# EAGLE design prometeo_002_non_plated (EAGLE 7.6.0)
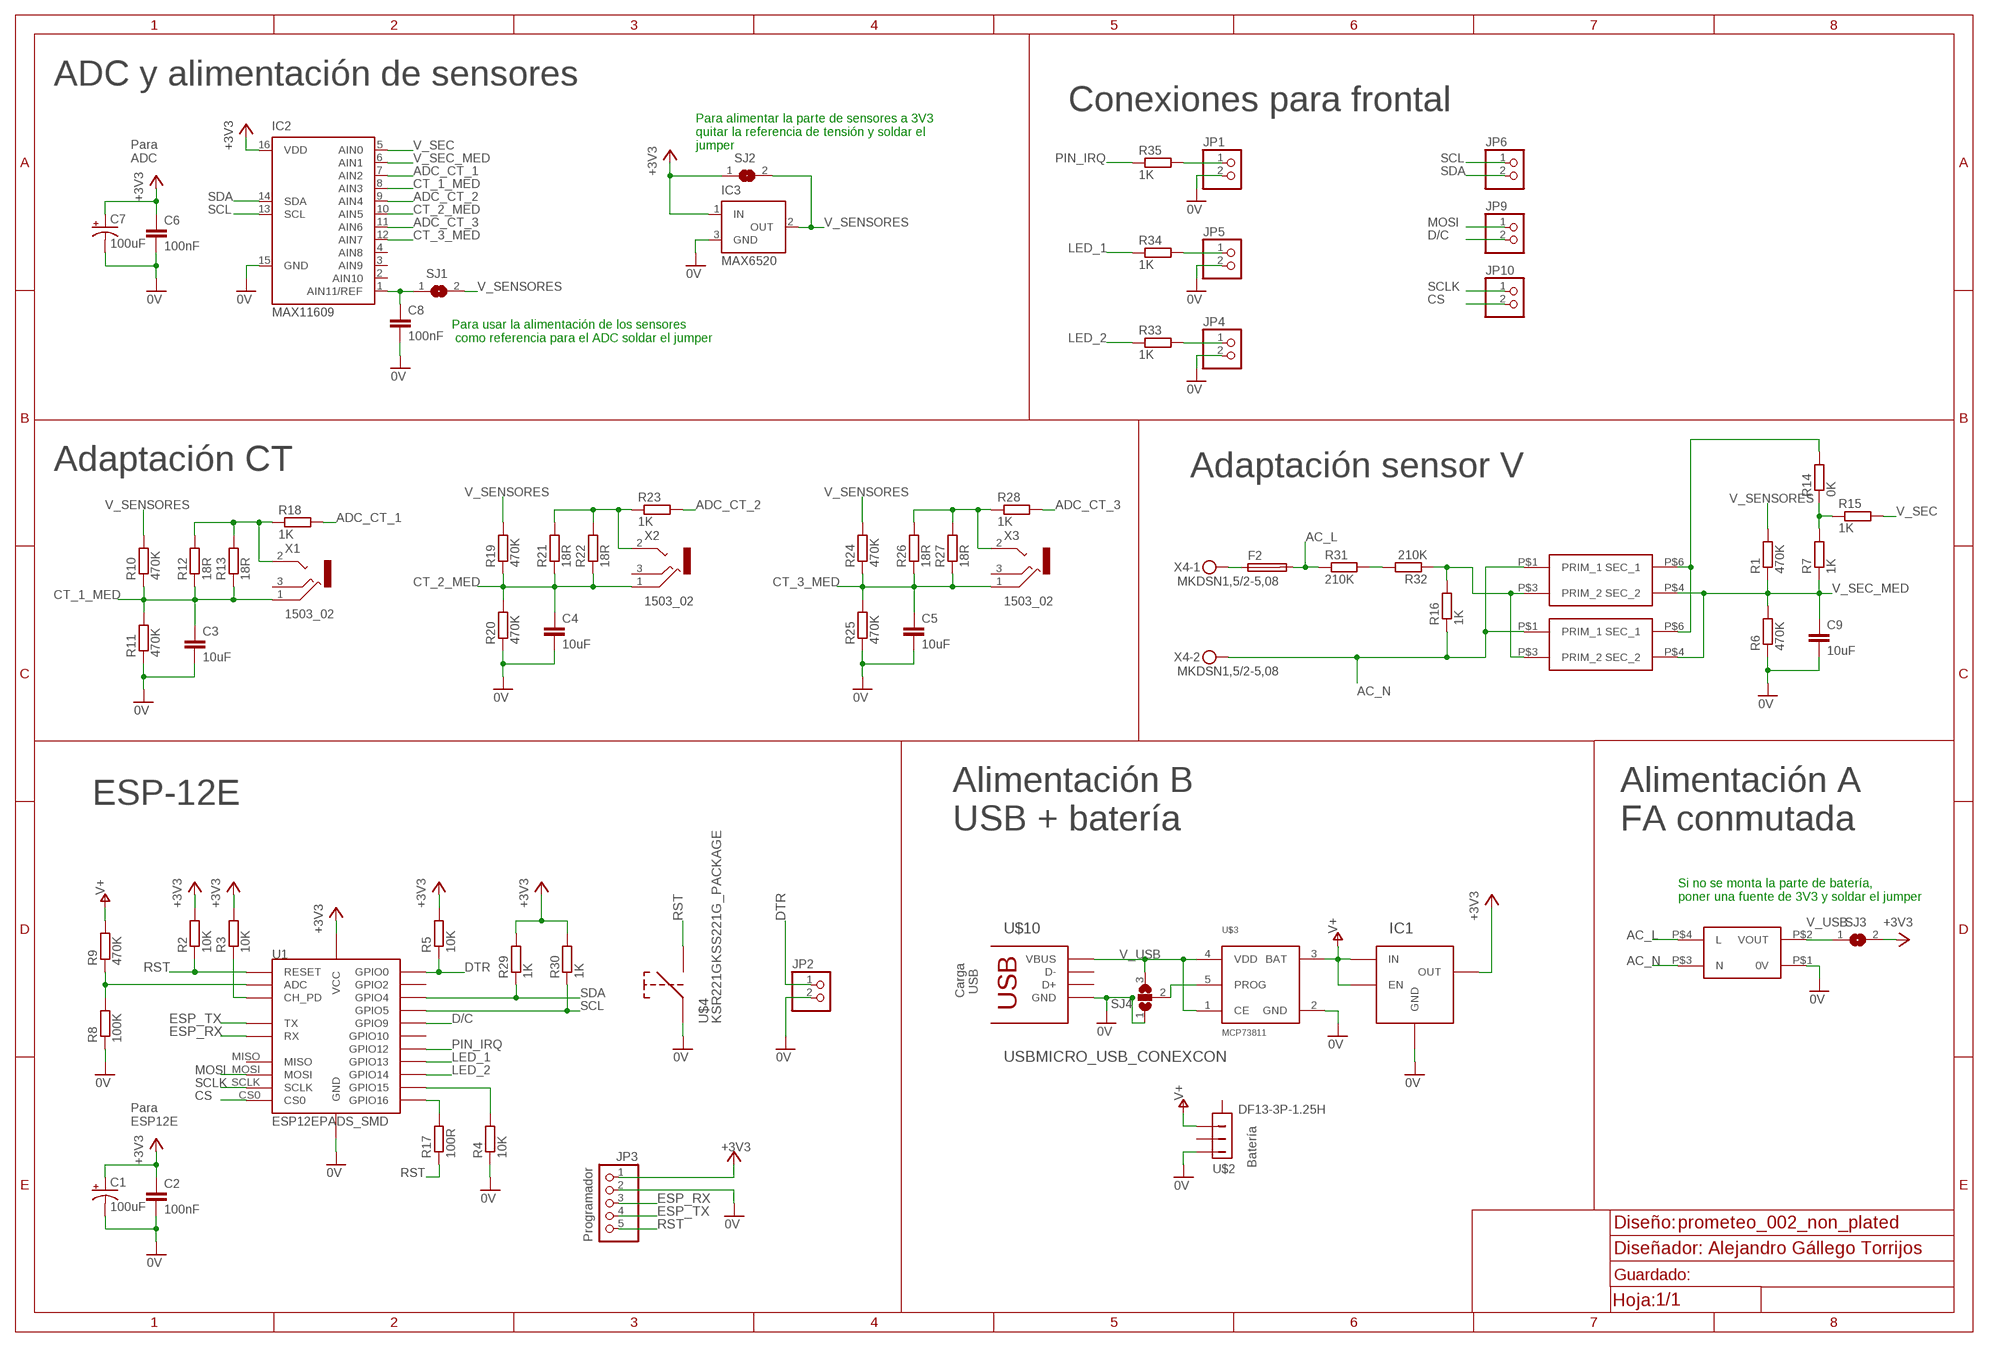
[diagram p0: schematic, sheet 1]

## Parts
C1  100uF  CPOL-USSMCC  [SMC_C]
C2  100nF  C-EUC0402  [C0402]
C3  10uF  C-EUC0805  [C0805]
C4  10uF  C-EUC0805  [C0805]
C5  10uF  C-EUC0805  [C0805]
C6  100nF  C-EUC0402  [C0402]
C7  100uF  CPOL-USSMCC  [SMC_C]
C8  100nF  C-EUC0402  [C0402]
C9  10uF  C-EUC0805  [C0805]
F2  MST 315MA 250V  TE5  [TE5]
IC1  STLQ015_SOT23-5L  [SOT23-5L]
IC2  MAX11609  [QSOP16]
IC3  MAX6520  [SOT23]
JP1  PINHD-1X2  [1X02]
JP2  PINHD-1X2  [1X02]
JP3  PINHD-1X5  [1X05]
JP4  PINHD-1X2  [1X02]
JP5  PINHD-1X2  [1X02]
JP6  PINHD-1X2/CIRC  [1X02/CIRC]
JP9  PINHD-1X2/CIRC  [1X02/CIRC]
JP10  PINHD-1X2/CIRC  [1X02/CIRC]
R1  470K  R-EU_R0402  [R0402]
R2  10K  R-EU_R0402  [R0402]
R3  10K  R-EU_R0402  [R0402]
R4  10K  R-EU_R0402  [R0402]
R5  10K  R-EU_R0402  [R0402]
R6  470K  R-EU_R0402  [R0402]
R7  1K  R-EU_R0402  [R0402]
R8  100K  R-EU_R0402  [R0402]
R9  470K  R-EU_R0402  [R0402]
R10  470K  R-EU_R0402  [R0402]
R11  470K  R-EU_R0402  [R0402]
R12  18R  R-EU_R1206  [R1206]
R13  18R  R-EU_0204/7  [0204/7]
R14  0K  R-EU_R0402  [R0402]
R15  1K  R-EU_R0402  [R0402]
R16  1K  R-EU_R1206  [R1206]
R17  100R  R-EU_R0402  [R0402]
R18  1K  R-EU_R0402  [R0402]
R19  470K  R-EU_R0402  [R0402]
R20  470K  R-EU_R0402  [R0402]
R21  18R  R-EU_R1206  [R1206]
R22  18R  R-EU_0204/7  [0204/7]
R23  1K  R-EU_R0402  [R0402]
R24  470K  R-EU_R0402  [R0402]
R25  470K  R-EU_R0402  [R0402]
R26  18R  R-EU_R1206  [R1206]
R27  18R  R-EU_0204/7  [0204/7]
R28  1K  R-EU_R0402  [R0402]
R29  1K  R-EU_R0402  [R0402]
R30  1K  R-EU_R0402  [R0402]
R31  210K  R-EU_R1206  [R1206]
R32  210K  R-EU_R1206  [R1206]
R33  1K  R-EU_R0402  [R0402]
R34  1K  R-EU_R0402  [R0402]
R35  1K  R-EU_R0402  [R0402]
SJ1  SJ  [SJ]
SJ2  SJ  [SJ]
SJ3  SJ  [SJ]
SJ4  SJ2W  [SJ_2]
U1  ESP12EPADS_SMD  [ESP12E_SMD]
U$2  DF13-3P-1.25H  [DF13A-3P-1.25H]
U$3  MCP73811  [SOT23-5L]
U$4  KSR221GKSS221G_PACKAGE  [SMD1]
U$5  PSU_VTX  [PSU_VTX]
U$6  TRAFO_AISLAMIENTOBOURNS_SM-LP-5001  [SM-LP-5001]
U$7  TRAFO_AISLAMIENTOETAL_P3191  [P3191]
U$10  USBMICRO_USB_CONEXCON  [MICROUSB_CONEXCON_5632]
X1  1503_02  [1503_02]
X2  1503_02  [1503_02]
X3  1503_02  [1503_02]
X4  MKDSN1,5/2-5,08  [MKDSN1,5/2-5,08]

## Nets
0V: C1.- C2.2 C3.2 C4.2 C5.2 C6.2 C7.- C8.2 C9.2 IC1.2(GND) IC2.15(GND) IC3.3(GND) JP1.2 JP2.2 JP3.2 JP4.2 JP5.2 R4.1 R6.1 R8.1 R11.1 R20.1 R25.1 SJ4.1 U1.GND U$2.P$1 U$3.2(GND) U$4.P$1 U$5.P$1(0V) U$10.GND U$10.GND1(GND) U$10.GND2(GND) U$10.P$8(GND) U$10.P$9(GND)
+3V3: C1.+ C2.1 C6.1 C7.+ IC1.5(OUT) IC2.16(VDD) IC3.1(IN) JP3.1 R2.2 R3.2 R5.2 R29.2 R30.2 SJ2.1 SJ3.2 U1.VCC
AC_L: F2.2 R31.1 U$5.P$4(L)
AC_N: R16.1 U$5.P$3(N) U$6.P$1(PRIM_1) U$7.P$1(PRIM_1) X4.2
ADC_CT_1: IC2.7(AIN2) R18.2
ADC_CT_2: IC2.9(AIN4) R23.2
ADC_CT_3: IC2.11(AIN6) R28.2
CS: JP10.2 U1.CS0
CT_1_MED: C3.1 IC2.8(AIN3) R10.1 R11.2 R12.1 R13.1 X1.1
CT_2_MED: C4.1 IC2.10(AIN5) R19.1 R20.2 R21.1 R22.1 X2.1
CT_3_MED: C5.1 IC2.12(AIN7) R24.1 R25.2 R26.1 R27.1 X3.1
D/C: JP9.2 U1.GPIO9
DTR: JP2.1 R5.1 U1.GPIO0
ESP_RX: JP3.3 U1.RXD(RX)
ESP_TX: JP3.4 U1.TXD(TX)
LED_1: R34.1 U1.GPIO13
LED_2: R33.1 U1.GPIO14
MOSI: JP9.1 U1.MOSI
N$1: R4.2 U1.GPIO15
N$2: R16.2 R32.1 U$6.P$3(PRIM_2) U$7.P$3(PRIM_2)
N$3: R3.1 U1.CH-PD(CH_PD)
N$4: R31.2 R32.2
N$5: R14.2 U$6.P$6(SEC_1) U$7.P$6(SEC_1)
N$6: F2.1 X4.1
N$7: R7.2 R14.1 R15.1
N$8: SJ4.2 U$3.5(PROG)
N$9: JP1.1 R35.2
N$10: R8.2 R9.1 U1.ADC
N$13: R12.2 R13.2 R18.1 X1.2
N$16: R17.2 U1.GPIO16
N$17: JP4.1 R33.2
N$18: R21.2 R22.2 R23.1 X2.2
N$19: JP5.1 R34.2
N$21: R26.2 R27.2 R28.1 X3.2
N$25: C8.1 IC2.1(AIN11/REF) SJ1.1
PIN_IRQ: R35.1 U1.GPIO12
RST: JP3.5 R2.1 R17.1 U1.RST(RESET) U$4.P$2
SCL: IC2.13(SCL) JP6.1 R30.1 U1.GPIO5
SCLK: JP10.1 U1.SCLK
SDA: IC2.14(SDA) JP6.2 R29.1 U1.GPIO4
V+: IC1.1(IN) IC1.3(EN) R9.2 U$2.P$3 U$3.3(BAT)
V_SEC: IC2.5(AIN0) R15.2
V_SEC_MED: C9.1 IC2.6(AIN1) R1.1 R6.2 R7.1 U$6.P$4(SEC_2) U$7.P$4(SEC_2)
V_SENSORES: IC3.2(OUT) R1.2 R10.2 R19.2 R24.2 SJ1.2 SJ2.2
V_USB: SJ3.1 SJ4.3 U$3.1(CE) U$3.4(VDD) U$5.P$2(VOUT) U$10.VBUS
Unconnected: IC2.2(AIN10) IC2.3(AIN9) IC2.4(AIN8) U1.GPIO2 U1.GPIO10 U1.MISO U$2.M$0 U$2.M$1 U$2.P$2 U$10.D+ U$10.D- X1.2@2 X1.3 X2.2@2 X2.3 X3.2@2 X3.3

## Notes on the sheet
- ADC y alimentación de sensores
- Conexiones para frontal
- Para alimentar la parte de sensores a 3V3 
  quitar la referencia de tensión y soldar el 
  jumper
- Para 
  ADC
- Para usar la alimentación de los sensores
   como referencia para el ADC soldar el jumper
- Adaptación CT | Adaptación sensor V
- ESP-12E
- Alimentación B
  USB + batería
- Alimentación A
  FA conmutada
- Si no se monta la parte de batería,
  poner una fuente de 3V3 y soldar el jumper
- Carga
   USB
- Para 
  ESP12E
- Batería
- Programador
- Diseñador: Alejandro Gállego Torrijos

## Library data of the parts
C1 C7 = rcl:CPOL-US: POLARIZED CAPACITOR, American symbol
C2-C6 C8 C9 = rcl:C-EU: CAPACITOR, European symbol
F2 = fuse:TE5: FUSE Wickmann; OC_FARNELL: unknown; OC_NEWARK: unknown
IC1 = libelium:STLQ015: ST => STLQ015XG33R
IC2 = libelium:MAX11609: 2.7V to 5.5V, Low-Power, 4-/12-Channel 2-Wire Serial 8-Bit ADCs Source: http://datasheets.maxim-ic.com/en/ds/MAX1036-MAX1039M.pdf
IC3 = maxim:MAX6520: 1.2V Voltage Reference 50ppm/°C, SOT23, 3-Terminal Source: Data sheet <http://datasheets.maxim-ic.com/en/ds/MAX6520.pdf>; MF: MAXIM; MPN: MAX6520EUR-T; OC_FARNELL: unknown; OC_NEWARK: 02J4586
JP1 JP2 JP4-JP6 JP9 JP10 = pinhead:PINHD-1X2: PIN HEADER
JP3 = pinhead:PINHD-1X5: PIN HEADER
R1-R35 = rcl:R-EU_: RESISTOR, European symbol
SJ1-SJ3 = jumper:SJ: SMD solder JUMPER
SJ4 = jumper:SJ2W: SMD solder JUMPER
U1 = esp8266modules:ESP12E
U$2 = libelium:DF13-3P-1.25: DF13-3P 1.25mm Pitch Miniature Crimping Connector.; MF: Hirose; MPN: DF13-3P-1.25H
U$3 = libelium:MCP73811
U$4 = libelium:KSR221G; MF: C&K Components; MPN: KSR221G LFS; OC_FARNELL: 1201421
U$5 = libelium:PSU_VTX
U$6 U$7 = libelium:TRAFO_AISLAMIENTO
U$10 = libelium:USB: Conexcon => 5632-16052E; MF: Conexcon; MPN: 5632-16052E
X1-X3 = con-lumberg:1503_02: Jack connectors according to JISC 6560, 3.5 mm Klinkeneinbaukupplung nach JISC 6560, 3,5 mm, 3-polig/stereo, abgewinkelte Ausführung, Surface-Mount-Technik (SMT) Source: http://www.lumberg.com/Produkte/PDFs/1503_02.pdf; OC_FARNELL: 1216979; OC_NEWARK: unknown
X4 = con-phoenix-508:MKDSN1,5/2-5,08: MKDSN 1,5/ 2-5,08 Printklemme Nennstrom: 13,5 A Nennspannung: 250 V Rastermaß: 5,08 mm Polzahl: 2 Anschlussart: Schraubanschluss Montage: Löten Anschlussrichtung Leiter/Platine: 0 ° Artikelnummer: 1729128 Source: http://eshop.phoenixcontact.com .. 1729128.pdf

## Board
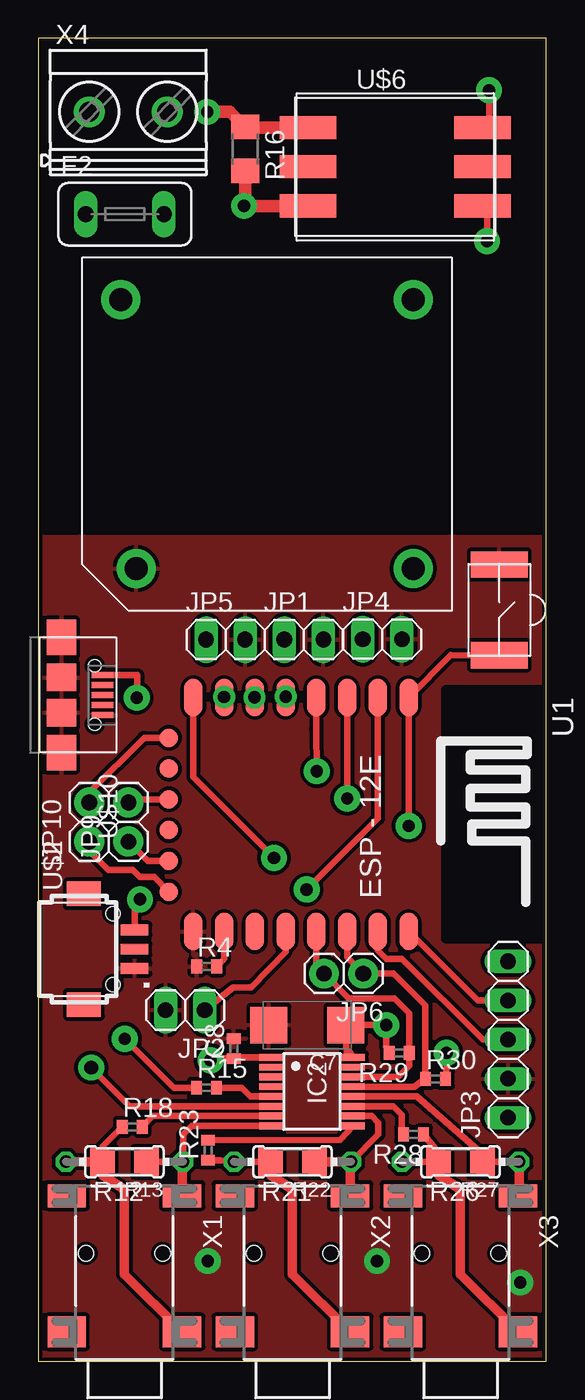
[diagram p1: board, top side]
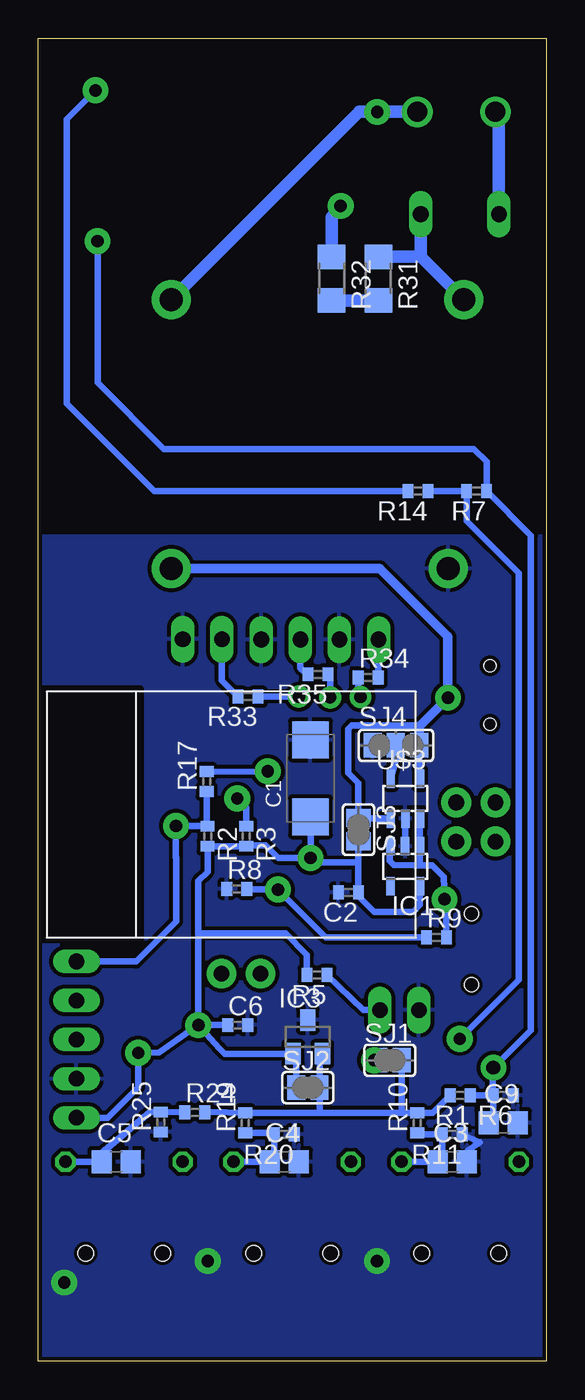
[diagram p2: board, bottom side, seen from below]

Size 33 x 86 mm. Coordinates in mm from the lower left corner, seen from the top.
Outline: 0,0 33,0 33,86 0,86 0,0
Copper layers (1*16): Top 0.035mm / dielectric 1.5mm / Bottom 0.035mm
Design rules "default *": minimum track width 10mil, minimum drill 24mil, track to track 0.2mm, track to pad 0.2mm, pad to pad 0.2mm, via to via 0.2mm, smd to smd 0.2mm, copper to edge 0.2mm, drill to drill 0.2mm, minimum pad ring 10mil, minimum via ring 8mil, stop-mask expansion 4mil, vias tented up to drill 0mil, thermal gap 10mil
tRestrict: area 26.4,27.4 to 32.8,43.7; area 0,54 to 33,86
bRestrict: area 26.4,27.4 to 32.8,43.7; area 0,54 to 33,86

### Footprints (pad centres in the part's own frame; a part is rotated, then mirrored left to right if it is on the bottom)
SMC_C = smd 2.4 x 2.4: + -2.5,0; - 2.5,0
C0402 = smd 0.7 x 0.9: 1 -0.65,0; 2 0.65,0
C0805 = smd 1.3 x 1.5: 1 -0.95,0; 2 0.95,0
TE5 = drill 1.016 long: 1 -2.54,0; 2 2.54,0
SOT23-5L = smd 0.55 x 1.2: 1 -0.95,-1.3; 2 0,-1.3; 3 0.95,-1.3; 4 0.95,1.3; 5 -0.95,1.3
QSOP16 = smd 0.45 x 1.5: 1 -2.223,-2.69; 2 -1.587,-2.69; 3 -0.953,-2.69; 4 -0.318,-2.69; 5 0.318,-2.69; 6 0.953,-2.69; 7 1.587,-2.69; 8 2.223,-2.69; 9 2.223,2.69; 10 1.587,2.69; 11 0.953,2.69; 12 0.318,2.69; 13 -0.318,2.69; 14 -0.953,2.69; 15 -1.587,2.69; 16 -2.223,2.69
SOT23 = smd 1 x 1.4: 1 -0.95,-1.1; 2 0.95,-1.1; 3 0,1.1
1X02 = drill 1.016 long: 1 -1.27,0; 2 1.27,0
1X05 = drill 1.016 long: 1 -5.08,0; 2 -2.54,0; 3 0,0; 4 2.54,0; 5 5.08,0
1X02/CIRC = drill 1.016 pad 1.93: 1 -1.27,0; 2 1.27,0
R0402 = smd 0.7 x 0.9: 1 -0.65,0; 2 0.65,0
R1206 = smd 1.6 x 1.803: 1 -1.422,0; 2 1.422,0
0204/7 = drill 0.813 octagon: 1 -3.81,0; 2 3.81,0
SJ = smd 1.168 x 1.6: 1 -0.762,0; 2 0.762,0
SJ_2 = smd 1.168 x 1.6: 1 -1.524,0; 2 0,0; 3 1.524,0
ESP12E_SMD = smd 2.413 x 1.194: ADC -7.239,4.706; CH-PD -7.239,2.706; GND 7.976,-7.294; GPIO0 7.976,-1.294; GPIO2 7.976,-3.294; GPIO4 7.976,0.706; GPIO5 7.976,2.706; GPIO12 -7.239,-3.294; GPIO13 -7.239,-5.294; GPIO14 -7.239,-1.294; GPIO15 7.976,-5.294; GPIO16 -7.239,0.706; RST -7.239,6.706; RXD 7.976,4.706; TXD 7.976,6.706; VCC -7.239,-7.294 | smd 1.194 x 1.194: CS0 -4.615,-8.89; GPIO9 -0.615,-8.89; GPIO10 1.385,-8.89; MISO -2.615,-8.89; MOSI 3.385,-8.89; SCLK 5.385,-8.89
DF13A-3P-1.25H = smd 1.6 x 2.2: M$0 -3.6,2.4; M$1 3.6,2.4 | smd 0.7 x 1.8: P$1 -1.25,-0.9; P$2 0,-0.9; P$3 1.25,-0.9 | hole 0.9: 2.3,0.5; -2.3,0.5
SMD1 = smd 1.7 x 3.7: P$1 2.95,0; P$2 -2.95,0
PSU_VTX = drill 1.5 pad 2.54: P$1 8.75,-8.5; P$2 8.75,9.5; P$3 -8.75,9.5; P$4 -8.75,-9.5
SM-LP-5001 = smd 2.5 x 1.5: P$1 -6.25,2.54; P$2 -6.25,0; P$3 -6.25,-2.54; P$4 6.25,-2.54; P$5 6.25,0; P$6 6.25,2.54
P3191 = smd 2.5 x 1.5: P$1 -5.08,2.54; P$2 -5.08,0; P$3 -5.08,-2.54; P$4 5.08,-2.54; P$5 5.08,0; P$6 5.08,2.54
MICROUSB_CONEXCON_5632 = smd 0.4 x 1.4: D+ 0,4.1; D- -0.65,4.1; GND 1.3,4.1; P$6 0.65,4.1; VBUS -1.3,4.1 | smd 2.3 x 1.9: GND1 -3.75,1.45; GND2 3.75,1.45 | smd 1.8 x 1.9: P$8 -1.15,1.45; P$9 1.15,1.45 | hole 0.8: -1.9,3.6; 1.9,3.6
1503_02 = smd 2.5 x 1.5: 1 -3.75,-10.75; 3 3.75,-10.75 | smd 2.5 x 2: 2 -3.75,-1.9; 2@2 3.75,-1.9 | hole 1: -2.5,-7; 2.5,-7
MKDSN1,5/2-5,08 = drill 1.3 pad 2: 1 -2.561,0.025; 2 2.519,0.025

### Placement (x,y rotation side)
C1  15.32,37.89 90 bottom
C2  12.85,30.48 180 bottom
C3  6.1,12.95 0 bottom
C4  17.02,12.95 0 bottom
C5  27.94,12.95 0 bottom
C6  20.05,21.84 0 bottom
C7  17.48,21.84 180 top
C8  12.7,20.32 90 top
C9  2.79,15.49 0 bottom
F2  5.61,74.57 0 top
IC1  9.16,32.17 180 bottom
IC2  17.78,17.53 270 top
IC3  15.49,21.08 0 bottom
JP1  17.25,46.91 0 top
JP2  9.54,22.82 180 top
JP3  30.53,20.9 90 top
JP4  22.35,46.94 0 top
JP5  12.17,46.91 0 top
JP6  19.84,25.2 180 top
JP9  5.84,35.05 90 top
JP10  3.3,35.05 90 top
R1  5.59,17.27 180 bottom
R2  22.01,34.13 270 bottom
R3  19.5,34.13 270 bottom
R4  10.94,25.66 0 top
R5  14.9,25.11 180 bottom
R6  2.79,17.27 180 bottom
R7  4.52,56.57 180 bottom
R8  20.12,30.7 0 bottom
R9  7.13,27.56 0 bottom
R10  8.38,15.49 90 bottom
R11  6.1,14.73 180 bottom
R12  5.59,12.95 180 top
R13  5.59,12.95 180 top
R14  8.33,56.57 180 bottom
R15  10.92,17.78 0 top
R16  13.44,78.82 270 top
R17  22.07,37.68 90 bottom
R18  6.1,15.24 0 top
R19  19.56,15.49 90 bottom
R20  17.02,14.73 180 bottom
R21  16.51,12.95 180 top
R22  16.51,12.95 180 top
R23  11.02,13.72 90 top
R24  22.83,16.18 0 bottom
R25  25.04,15.54 90 bottom
R26  27.43,12.95 180 top
R27  27.43,12.95 180 top
R28  24.38,14.73 180 top
R29  23.44,20.04 180 top
R30  25.81,18.34 0 top
R31  10.9,70.38 270 bottom
R32  13.95,70.38 270 bottom
R33  19.38,43.21 180 bottom
R34  11.56,44.45 0 bottom
R35  14.83,44.65 180 bottom
SJ1  10.16,19.56 0 bottom
SJ2  15.49,17.78 0 bottom
SJ3  12.2,34.54 270 bottom
SJ4  9.76,40.03 0 bottom
U1  17.36,35.9 270 top
U$2  5.35,26.78 90 top
U$3  9.15,36.58 0 bottom
U$4  29.95,48.84 90 top
U$5  14.86,60.28 270 top
U$6  23.19,77.65 0 top
U$7  23.19,77.65 0 top
U$10  0.05,43.31 270 top
X1  5.59,0 180 top
X2  16.51,0 180 top
X3  27.43,0 180 top
X4  5.86,81.2 0 top

### Tracks (layer width: path | path; a pad name or v marks a point on that pad's centre or on a via)
0V  (via drill 0.8 pad 1.68)
  Bottom 0.406: U$3.2 IC1.2 | R11.1 4.32,14.22 5.08,13.72 C3.2
  other vias: 22,6.5 11,6.5 31.32,5.1
  pour Bottom (isolate 0.254): 0,0 33,0 33,54 0,54
  pour Top (isolate 0.254): 0,0 33,0 33,54 0,54
+3V3  (via drill 0.8 pad 1.68)
  Top 0.406: 20.28,20.07 IC2.16 20.03,19.81 C7.+ v22.61,21.84 22.61,20.43 R29.2 | R30.2 26.53,19.07 v26.52,20.04 | U1.VCC 10.07,37.97 v15.32,32.72
  Bottom 0.406: v22.61,21.84 21.24,20.35 20.88,19.98 IC3.1 16.26,19.79 SJ2.1 | v22.61,21.84 25.15,20.07 v26.52,20.04 26.52,17.8 28.5,15.82 JP3.1 | IC1.5 8.21,29.64 8.64,29.21 11.18,29.21 12.2,30.23 C2.1 12.2,32.43 12.2,32.44 | 12.2,32.44 SJ3.2 12.69,34.04 | C6.1 v22.61,21.84 | v22.61,21.84 22.61,27.79 | 22.61,27.79 22.61,31.22 22.01,31.82 R2.2 R3.2 19.45,33.53 18.24,33.53 17.42,32.72 v15.32,32.72 | R5.2 15.55,26.42 16.94,27.81 22.58,27.81 22.61,27.79 | v15.32,32.72 C1.+ | v15.32,32.72 15.04,32.44 12.2,32.44
AC_L
  Bottom 0.813: F2.2 8.15,71.82 | 8.15,71.82 U$5.P$4 | 8.15,71.82 8.2,71.86 8.26,71.8 R31.1
AC_N  (via drill 0.8 pad 1.68)
  Top 0.813: U$7.P$1 U$6.P$1 13.49,80.19 R16.1 12.45,81.22 v10.97,81.22
  Bottom 0.813: U$5.P$3 12.16,81.22 v10.97,81.22 9.04,81.22 X4.2
ADC_CT_1
  Top 0.406: IC2.7 7.44,15.94 R18.2
ADC_CT_2
  Top 0.406: R23.2 19.62,14.38 IC2.9
ADC_CT_3
  Top 0.406: IC2.11 23.05,16.57 23.62,16 23.62,14.84 R28.2
CS
  Top 0.406: JP10.2 3.3,36.96 6.86,40.52 U1.CS0
CT_1_MED
  Top 0.406: R12.1 R13.1 9.4,14.73 9.97,15.3 IC2.8
  Top 0.61: R13.1 9.34,12.95 X1.1
  Bottom 0.406: R13.1 C3.1 6.75,13.25 R11.2 8.27,14.73 R10.1
CT_2_MED
  Top 0.406: IC2.10 21.65,15.94 22.1,15.49 22.1,14.73 R22.1
  Top 0.61: R21.1 R22.1 20.26,12.89 X2.1
  Bottom 0.406: R22.1 C4.1 17.67,13.25 R20.2 17.78,14.84 R19.1
CT_3_MED
  Top 0.406: R27.1 R26.1 28.85,13.46 24.6,17.21 IC2.12
  Top 0.61: R27.1 31.24,10.81 X3.1
  Bottom 0.406: R27.1 C5.1 28.91,12.95 28.91,13.51 25.72,16.2 R25.2 R24.1
D/C
  Top 0.406: U1.GPIO9 6.04,36.52 JP9.2
DTR
  Top 0.406: U1.GPIO0 16.07,26.61 13.84,24.28 12.65,24.28 JP2.1
  Bottom 0.406: JP2.1 11.88,22.84 R5.1
ESP_RX
  Top 0.406: U1.RXD 22.07,26.7 22.61,26.16 23.62,26.16 28.88,20.9 JP3.3
ESP_TX
  Top 0.406: U1.TXD 28.55,23.44 JP3.4
LED_1  (via drill 0.8 pad 1.42)
  Top 0.406: U1.GPIO13 v12.06,43.18
  Bottom 0.406: v12.06,43.18 12.21,43.32 R34.1
LED_2  (via drill 0.8 pad 1.42)
  Top 0.406: U1.GPIO14 16,43.21 v16.07,43.2
  Bottom 0.406: v16.07,43.2 v16.08,43.2 R33.1
MOSI
  Top 0.406: U1.MOSI 7.11,32.52 JP9.1
N$1
  Top 0.406: 12.09,28.66 U1.GPIO15 12.07,26.14 R4.2
N$2  (via drill 0.8 pad 1.68)
  Top 0.813: 13.34,75.11 v13.36,75.11 U$6.P$3 U$7.P$3 | 13.36,75.06 13.34,75.11 | R16.2 13.44,75.21 13.34,75.11
  Bottom 0.813: R32.1 13.95,74.39 v13.36,75.11
N$3  (via drill 0.8 pad 1.68)
  Top 0.406: U1.CH-PD 20.07,41.1 v20.07,36.58
  Bottom 0.406: v20.07,36.58 19.5,36 R3.1
N$4
  Bottom 0.813: R31.2 R32.2
N$5  (via drill 0.8 pad 1.68)
  Top 0.406: v29.29,82.63 29.29,80.34 | 29.29,80.34 U$6.P$6 | 29.29,80.34 28.42,80.34 U$7.P$6
  Bottom 0.406: R14.2 25.48,56.57 31.17,62.26 31.17,80.75 v29.29,82.63
N$6
  Bottom 0.813: X4.1 3.07,81.22 F2.1
N$7  (via drill 0.8 pad 1.68)
  Top 0.406: R15.1 8.79,17.78 v5.61,20.95
  Bottom 0.406: R14.1 R7.2 5.16,56.55 5.16,54.61 1.78,51.23 1.78,24.79 v5.61,20.95
N$8
  Bottom 0.406: U$3.5 9.75,39.21 SJ4.2
N$9
  Bottom 0.406: R35.2 15.98,45.07 JP1.1
N$10  (via drill 0.8 pad 1.68)
  Top 0.406: U1.ADC 22.07,35.27 v17.43,30.66
  Bottom 0.406: R9.1 14.33,27.56 v17.43,30.66 19.42,30.66 R8.2
N$13
  Top 0.406: R12.2 4.17,13.96 R18.1
  Top 0.61: R13.2 R12.2 4.17,12.09 5.59,11.18 5.59,5.65 X1.2
N$16  (via drill 0.8 pad 1.68)
  Top 0.406: U1.GPIO16 18.04,41.09 v18.09,38.35
  Bottom 0.406: v18.09,38.35 18.77,38.32 R17.2
N$17
  Bottom 0.406: R33.2 21.08,44.26 JP4.1
N$18
  Top 0.406: R21.2 R22.2 11.83,13.07 R23.1
  Top 0.61: R21.2 15.09,12.09 16.51,11.18 16.51,5.65 X2.2
N$19
  Bottom 0.406: JP5.1 R34.2
N$21
  Top 0.406: R27.2 R26.2 26.01,13.5 R28.1
  Top 0.61: R26.2 26.01,12.09 27.43,11.18 27.43,5.65 X3.2
N$25  (via drill 0.8 pad 1.68)
  Top 0.406: IC2.1 12.78,19.75 C8.1 11.8,19.67 v11.18,19.56
  Bottom 0.406: v11.18,19.56 SJ1.1
PIN_IRQ  (via drill 0.8 pad 1.42)
  Top 0.406: U1.GPIO12 14.05,43.16 v14.05,43.16
  Bottom 0.406: v14.05,43.16 14.05,44.44 R35.1
RST  (via drill 0.8 pad 1.68)
  Top 0.406: v24.07,34.8 U1.RST 26.81,45.91 U$4.P$2
  Bottom 0.406: R17.1 22.07,34.84 R2.1 22.03,34.8 v24.07,34.8 24.07,32.75 24.05,32.74 24.05,28.57 26.66,25.97 26.67,25.98 JP3.5
SCL
  Top 0.406: IC2.13 24.43,17.84 R30.1 25.13,23.11 23.05,25.2 JP6.1 20.07,26.24 U1.GPIO5
SCLK
  Top 0.406: U1.SCLK 7.52,31.47 6.58,31.47 6.12,31.93 4.55,31.93 3.3,33.17 JP10.1
SDA
  Top 0.406: IC2.14 23.38,18.48 24.09,19.19 R29.1 24.09,22.62 23.11,23.6 20.17,23.6 JP6.2 18.07,25.7 U1.GPIO4
V+  (via drill 0.8 pad 1.68)
  Top 0.406: U$2.P$3 6.25,29.39 v6.6,30.02
  Bottom 0.406: U$3.3 IC1.1 8.21,32.69 8.21,32.29 | 8.21,32.29 8.26,32.23 9.91,32.26 10.17,32.51 10.17,33.41 IC1.3 | 8.21,32.29 8.5,32.23 7.39,32.23 6.66,31.49 v6.6,30.02 6.48,29.62 R9.2
V_SEC
  Top 0.406: IC2.5 13.78,17.21 13.21,17.78 R15.2
V_SEC_MED  (via drill 0.8 pad 1.68, 0.9 pad 1.68)
  Top 0.406: IC2.6 5.93,16.57 v3.43,19.07 | v29.16,72.82 29.16,74.83 | 29.16,74.83 U$6.P$4 | 29.16,74.83 28.55,74.83 U$7.P$4
  Bottom 0.406: R6.2 R1.1 4.42,17.27 | C9.1 3.44,15.79 R6.2 | R6.2 3.48,17.32 3.48,19.02 v3.43,19.07 0.99,21.51 0.99,53.69 R7.1 3.87,58.48 4.7,59.31 24.84,59.31 29.16,63.63 v29.16,72.82
V_SENSORES
  Bottom 0.406: 9.4,16.14 R10.2 7.37,16.14 R1.2 | 9.4,16.14 14.73,16.14 | 14.73,16.14 R19.2 21.87,16.2 R24.2 | 14.73,16.14 SJ2.2 14.73,19.79 IC3.2 | SJ1.2 9.4,16.14
V_USB  (via drill 0.8 pad 1.68)
  Top 0.406: U$10.VBUS 6.43,44.61 v6.38,43.13
  Bottom 0.406: U$3.1 12.17,35.28 SJ3.1 12.2,37.58 12.88,38.25 12.88,41.1 12.64,41.33 8.18,41.33 | U$3.4 8.24,37.91 SJ4.3
  Bottom 0.61: SJ4.3 8.24,41.27 8.18,41.33 v6.38,43.13 6.38,47.1 10.81,51.53 U$5.P$2